# Altium schematic sheet Power for Master.SchDoc
size Legal
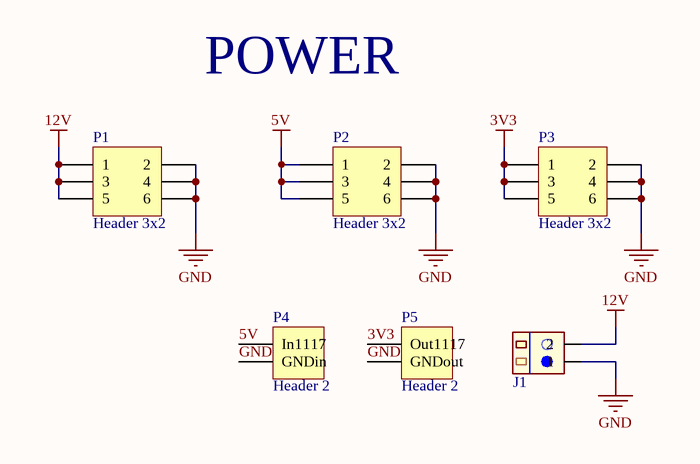
[diagram p0: Power for Master.SchDoc]

## Parts
J1  CON.Domino2  [Domino 2M]  (value not drawn)
P1  Header 3x2  [Header 3x2]
P2  Header 3x2  [Header 3x2]
P3  Header 3x2  [Header 3x2]
P4  Header 2  [HDR1X2]
P5  Header 2  [HDR1X2]

## Nets
3V3: P3.1 P3.3 P3.5 P5.1(Out1117)
5V: P2.1 P2.3 P2.5 P4.1(In1117)
12V: J1.2 P1.1 P1.3 P1.5
GND: J1.1 P1.2 P1.4 P1.6 P2.2 P2.4 P2.6 P3.2 P3.4 P3.6 P4.2(GNDin) P5.2(GNDout)

## Notes on the sheet
- POWER

## Library data of the parts
J1 = CON.Domino2: 2 pins Domino Header; Publisher: Hoang Nguyen; ComponentLink1Description: Digikey Part link; ComponentLink2Description: Open DataSheet; ComponentLink2URL: H:\LIBRARY\LIBRARY.Datasheet\; Price: 2000VND
P1-P3 = Header 3x2: Header, 6-Pin, 2-Row; LatestRevisionDate: 17-Jul-2002; LatestRevisionNote: Re-released for DXP Platform.; Publisher: Altium Limited
P4 P5 = Header 2: Header, 2-Pin; LatestRevisionDate: 17-Jul-2002; LatestRevisionNote: Re-released for DXP Platform.; Publisher: Altium Limited